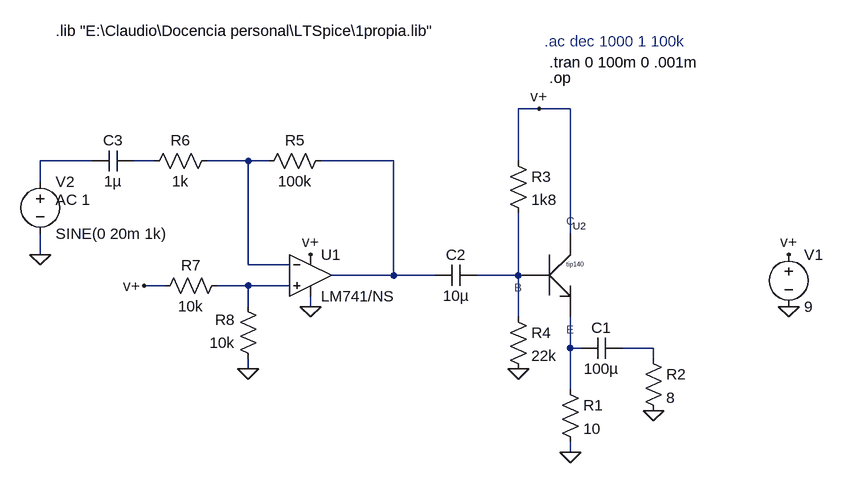
[diagram p0: schematic audioclasea.asc]
audioclasea.asc, the LTspice schematic file:
Version 4
SHEET 1 1316 680
WIRE 624 -176 592 -176
WIRE 672 -176 624 -176
WIRE -64 -96 -144 -96
WIRE 32 -96 0 -96
WIRE 176 -96 112 -96
WIRE 208 -96 176 -96
WIRE 400 -96 288 -96
WIRE 592 -96 592 -176
WIRE -144 -64 -144 -96
WIRE 672 16 672 -176
WIRE -144 48 -144 16
WIRE 176 64 176 -96
WIRE 240 64 176 64
WIRE 400 80 400 -96
WIRE 400 80 304 80
WIRE 464 80 400 80
WIRE 592 80 592 -16
WIRE 592 80 528 80
WIRE 48 96 16 96
WIRE 176 96 128 96
WIRE 240 96 176 96
WIRE 176 128 176 96
WIRE 272 128 272 112
WIRE 592 144 592 80
WIRE 672 192 672 144
WIRE 688 192 672 192
WIRE 800 192 752 192
WIRE 800 208 800 192
WIRE 176 224 176 208
WIRE 672 256 672 192
WIRE 672 352 672 336
FLAG 1008 128 0
FLAG 672 352 0
FLAG 800 288 0
FLAG 592 224 0
FLAG -144 48 0
FLAG 272 128 0
FLAG 1008 48 v+
FLAG 272 48 v+
FLAG 624 -176 v+
FLAG 16 96 v+
FLAG 176 224 0
DATAFLAG 576 80 ""
DATAFLAG 400 80 ""
SYMBOL Propia\\Darlington\ npn 640 80 R0
SYMATTR Value tip140
SYMATTR InstName U2
SYMBOL voltage 1008 32 R0
WINDOW 123 0 0 Left 0
WINDOW 39 0 0 Left 0
SYMATTR InstName V1
SYMATTR Value 9
SYMBOL res 656 240 R0
SYMATTR InstName R1
SYMATTR Value 10
SYMBOL cap 752 176 R90
WINDOW 0 0 32 VBottom 2
WINDOW 3 32 32 VTop 2
SYMATTR InstName C1
SYMATTR Value 100µ
SYMBOL res 784 192 R0
SYMATTR InstName R2
SYMATTR Value 8
SYMBOL res 576 -112 R0
SYMATTR InstName R3
SYMATTR Value 1k8
SYMBOL res 576 128 R0
SYMATTR InstName R4
SYMATTR Value 22k
SYMBOL cap 528 64 R90
WINDOW 0 0 32 VBottom 2
WINDOW 3 32 32 VTop 2
SYMATTR InstName C2
SYMATTR Value 10µ
SYMBOL OpAmps\\opamp2 272 16 R0
SYMATTR InstName U1
SYMATTR Value LM741/NS
SYMBOL res 304 -112 R90
WINDOW 0 0 56 VBottom 2
WINDOW 3 32 56 VTop 2
SYMATTR InstName R5
SYMATTR Value 100k
SYMBOL res 128 -112 R90
WINDOW 0 0 56 VBottom 2
WINDOW 3 32 56 VTop 2
SYMATTR InstName R6
SYMATTR Value 1k
SYMBOL voltage -144 -80 R0
WINDOW 123 24 44 Left 2
WINDOW 39 0 0 Left 0
SYMATTR Value2 AC 1
SYMATTR InstName V2
SYMATTR Value SINE(0 20m 1k)
SYMBOL cap 0 -112 R90
WINDOW 0 0 32 VBottom 2
WINDOW 3 32 32 VTop 2
SYMATTR InstName C3
SYMATTR Value 1µ
SYMBOL res 144 80 R90
WINDOW 0 0 56 VBottom 2
WINDOW 3 32 56 VTop 2
SYMATTR InstName R7
SYMATTR Value 10k
SYMBOL res 192 224 R180
WINDOW 0 36 76 Left 2
WINDOW 3 36 40 Left 2
SYMATTR InstName R8
SYMATTR Value 10k
TEXT 640 -224 Left 2 !.op
TEXT -120 -296 Left 2 !.lib "E:\\Claudio\\Docencia personal\\LTSpice\\1propia.lib"
TEXT 640 -248 Left 2 !.tran 0 100m 0 .001m
TEXT 632 -280 Left 2 ;.ac dec 1000 1 100k

The netlist it stands for:
* audioclasea.asc
XU2 v+ N005 N007 tip140  ; pins C B E
V1 v+ 0 9
R1 N007 0 10
C1 N008 N007 100µ
R2 N008 0 8
R3 v+ N005 1k8
R4 N005 0 22k
C2 N005 N004 10µ
XU1 N006 N003 v+ 0 N004 LM741/NS  ; pins In+ In- V+ V- OUT
R5 N004 N003 100k
R6 N003 N002 1k
V2 N001 0 SINE(0 20m 1k) AC 1
C3 N002 N001 1µ
R7 N006 v+ 10k
R8 0 N006 10k
.op
.lib "E:\Claudio\Docencia personal\LTSpice\1propia.lib"
.tran 0 100m 0 .001m
* .ac dec 1000 1 100k
.backanno
.end